# EAGLE design schematic (EAGLE 9.2.2)
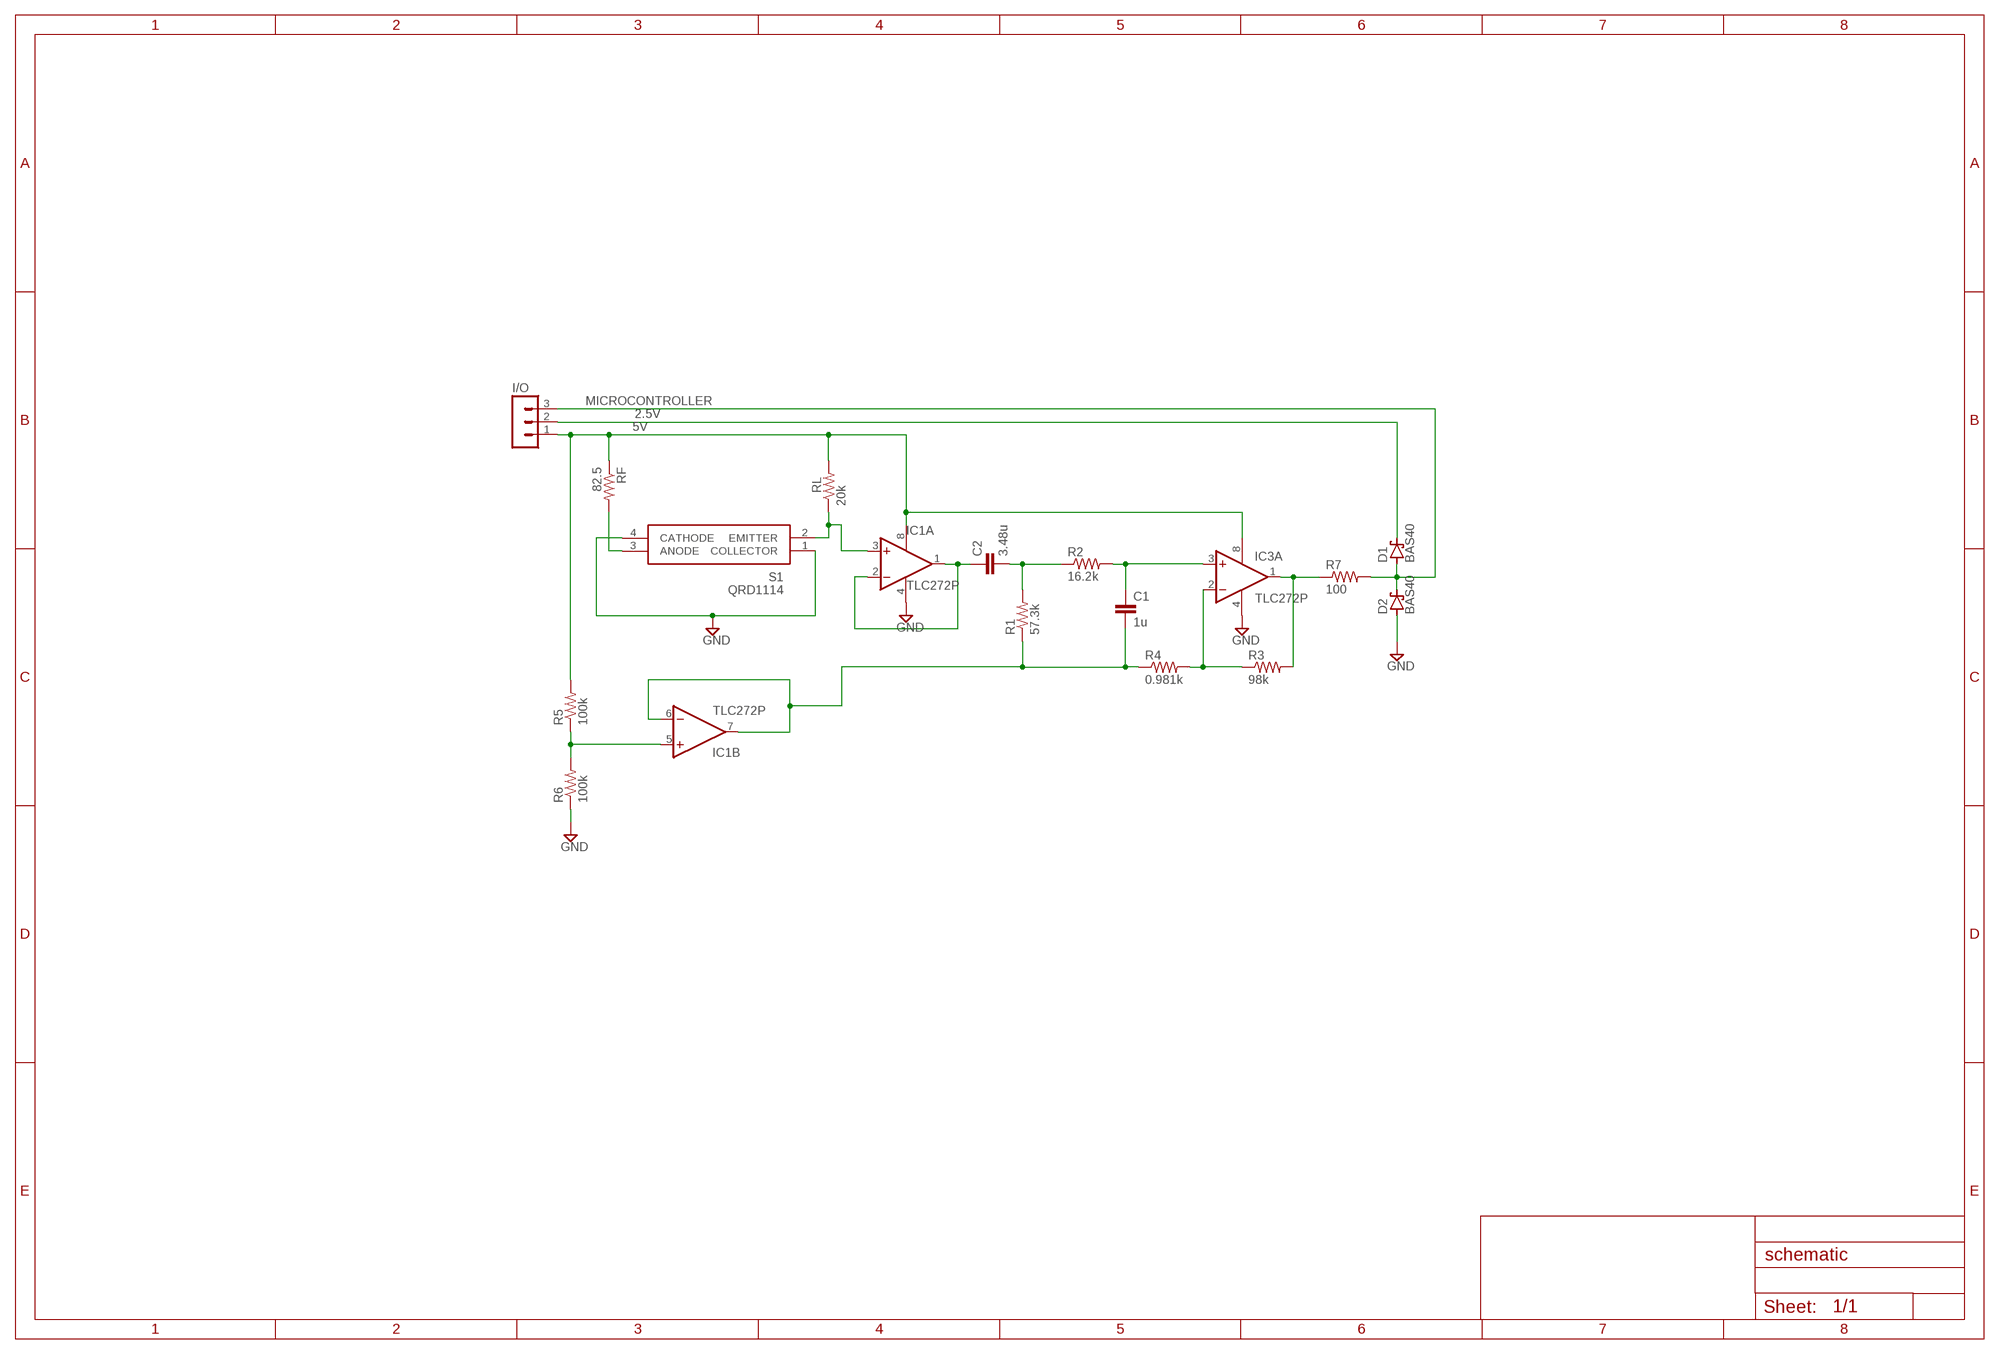
[diagram p0: schematic, sheet 1]

## Parts
C1  1u  C-EUC0402  [C0402]
C2  3.48u  C-EUC0402  [C0402]
D1  BAS40  [SOT23]
D2  BAS40  [SOT23]
I/O  MA03-1  [MA03-1]
IC1  TLC272P  [DIL08]
IC3  TLC272P  [DIL08]
R1  57.3k  R-US_M0805  [M0805]
R2  16.2k  R-US_M0805  [M0805]
R3  98k  R-US_M0805  [M0805]
R4  0.981k  R-US_M0805  [M0805]
R5  100k  R-US_M0805  [M0805]
R6  100k  R-US_0204/5  [0204/5]
R7  100  R-US_M0805  [M0805]
RF  82.5  R-US_M0805  [M0805]
RL  20k  R-US_M0805  [M0805]
S1  QRD1114  [CUSTOM_4L]

## Nets
2.5V: D1.3(C) I/O.2
5V: I/O.1 IC1.8(P:V+) IC3.8(P:V+) R5.2 RF.1 RL.2
GND: D2.1(A) IC1.4(P:V-) IC3.4(P:V-) R6.1 S1.1(COLLECTOR) S1.4(CATHODE)
MICROCONTROLLER: D1.1(A) D2.3(C) I/O.3 R7.2
N$1: RF.2 S1.3(ANODE)
N$2: IC1.3(A:+IN) RL.1 S1.2(EMITTER)
N$3: C2.1 IC1.1(A:OUT) IC1.2(A:-IN)
N$4: IC1.5(B:+IN) R5.1 R6.2
N$9: C2.2 R1.2 R2.1
N$10: C1.1 IC3.3(A:+IN) R2.2
N$11: C1.2 IC1.6(B:-IN) IC1.7(B:OUT) R1.1 R4.1
N$12: IC3.2(A:-IN) R3.1 R4.2
N$13: IC3.1(A:OUT) R3.2 R7.1
Unconnected: IC3.5(B:+IN) IC3.6(B:-IN) IC3.7(B:OUT)

## Library data of the parts
C1 C2 = rcl:C-EU: CAPACITOR, European symbol; SPICEPREFIX: C
D1 D2 = diode:BAS40: Silicon Schottky Diodes General-purpose diode for high-speed switching
I/O = con-lstb:MA03-1: PIN HEADER; OC_FARNELL: unknown; OC_NEWARK: unknown
IC1 IC3 = linear:TLC272: OP AMP
R1-R7 RF RL = rcl:R-US_: RESISTOR, American symbol; SPICEPREFIX: R
S1 = SamacSys_Parts:QRD1114: FAIRCHILD SEMICONDUCTOR - QRD1114 - OPTO SWITCH, REFLECTIVE Source: Datasheet <https://componentsearchengine.com/Datasheets/1/QRD1114.pdf>; DESCRIPTION: FAIRCHILD SEMICONDUCTOR - QRD1114 - OPTO SWITCH, REFLECTIVE; HEIGHT: mm; MANUFACTURER_NAME: Fairchild Semiconductor; MANUFACTURER_PART_NUMBER: QRD1114; MOUSER_PART_NUMBER: 512-QRD1114; MOUSER_PRICE-STOCK: https://www.mouser.com/Search/Refine.aspx?Keyword=512-QRD1114

## Board
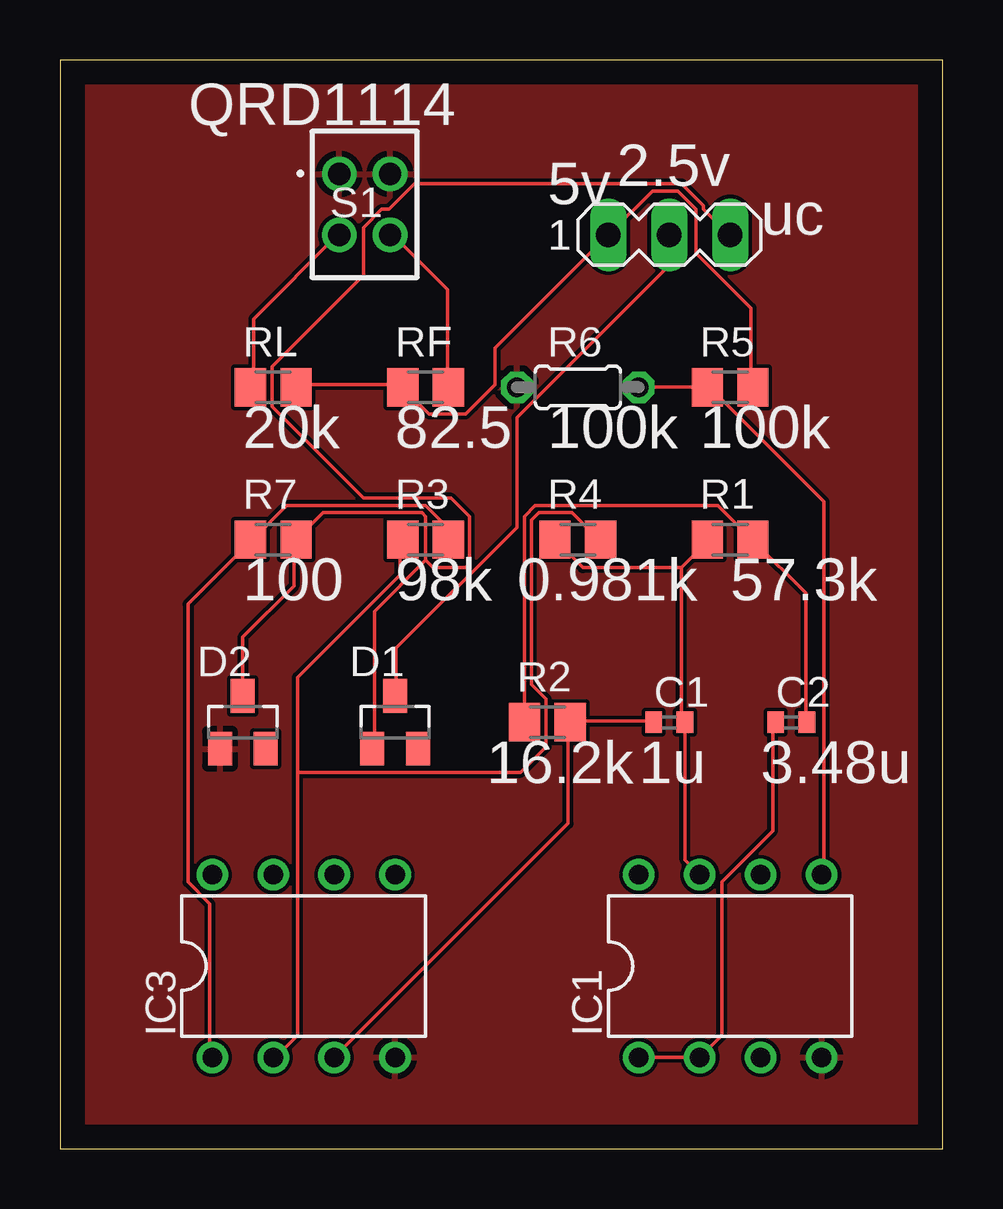
[diagram p1: board, top side]
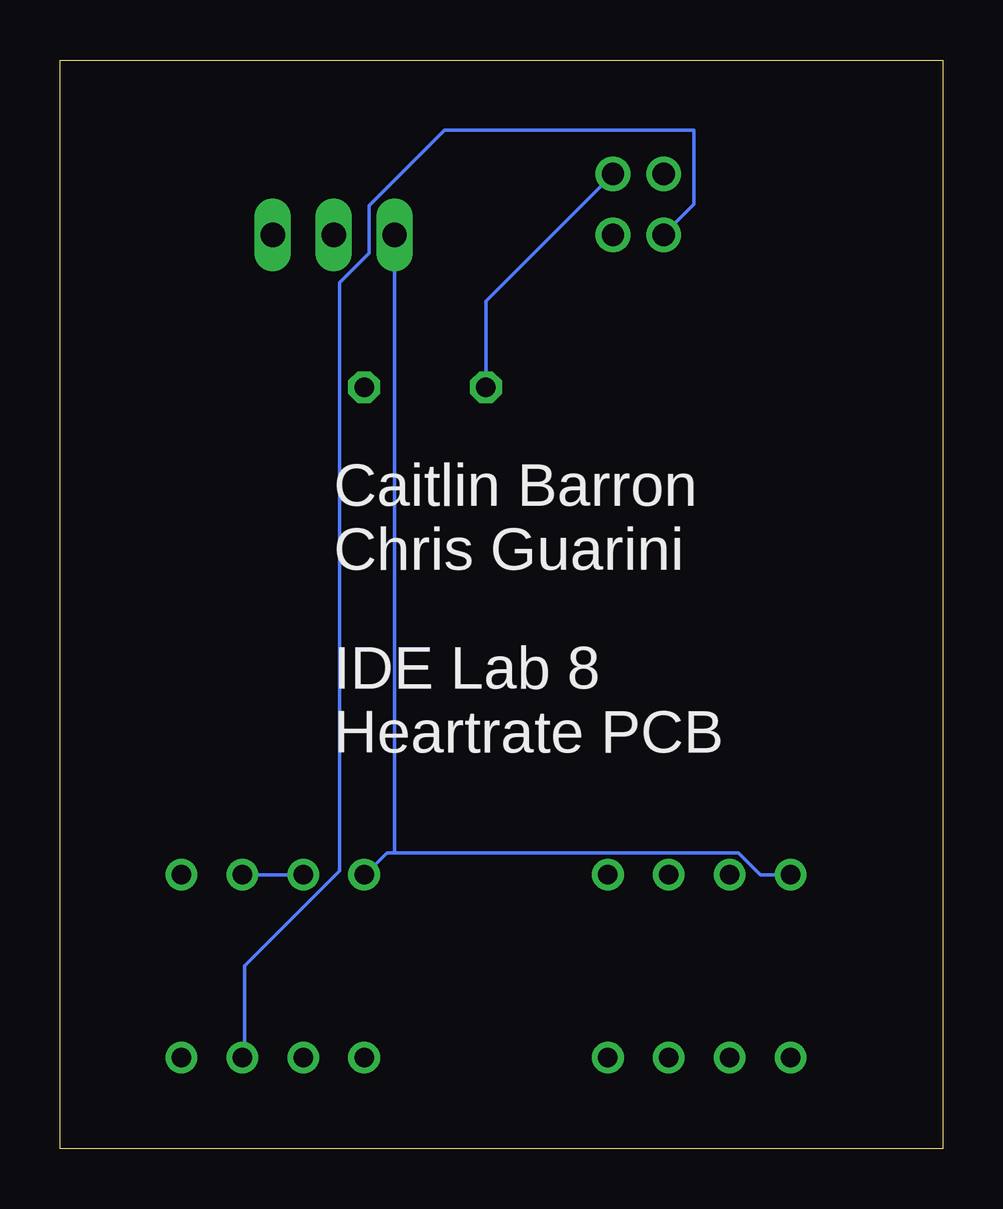
[diagram p2: board, bottom side, seen from below]

Size 36.81 x 45.39 mm. Coordinates in mm from the lower left corner, seen from the top.
Outline: 0,0 36.81,0 36.81,45.39 0,45.39 0,0
Copper layers (1*16): Top 0.035mm / dielectric 1.5mm / Bottom 0.035mm
Design rules "default": minimum track width 6mil, minimum drill 0.35mm, track to track 6mil, track to pad 6mil, pad to pad 6mil, via to via 6mil, smd to smd 6mil, copper to edge 40mil, drill to drill 6mil, minimum pad ring 10mil, minimum via ring 8mil, stop-mask expansion 4mil, vias tented up to drill 0mil, thermal gap 10mil

### Footprints (pad centres in the part's own frame; a part is rotated, then mirrored left to right if it is on the bottom)
C0402 = smd 0.7 x 0.9: 1 -0.65,0; 2 0.65,0
SOT23 = smd 1 x 1.4: 1 -0.95,-1.1; 2 0.95,-1.1; 3 0,1.1
MA03-1 = drill 1.016 long: 1 -2.54,0; 2 0,0; 3 2.54,0
DIL08 = drill 0.813 pad 1.27: 1 -3.81,-3.81; 2 -1.27,-3.81; 3 1.27,-3.81; 4 3.81,-3.81; 5 3.81,3.81; 6 1.27,3.81; 7 -1.27,3.81; 8 -3.81,3.81
M0805 = smd 1.3 x 1.6: 1 -0.95,0; 2 0.95,0
0204/5 = drill 0.813 octagon: 1 -2.54,0; 2 2.54,0
CUSTOM_4L = drill 0.92 pad 1.45: 1 -1.055,1.27; 2 -1.055,-1.27; 3 1.055,-1.27; 4 1.055,1.27

### Placement (x,y rotation side)
C1  25.4,17.78 0 top
C2  30.48,17.78 0 top
D1  13.97,17.78 0 top
D2  7.62,17.78 0 top
I/O  25.4,38.1 0 top
IC1  27.94,7.62 0 top
IC3  10.16,7.62 0 top
R1  27.94,25.4 0 top
R2  20.32,17.78 0 top
R3  15.24,25.4 0 top
R4  21.59,25.4 0 top
R5  27.94,31.75 0 top
R6  21.59,31.75 0 top
R7  8.89,25.4 0 top
RF  15.24,31.75 0 top
RL  8.89,31.75 0 top
S1  12.7,39.37 0 top

### Tracks (layer width: path | path; a pad name or v marks a point on that pad's centre or on a via)
2.5V
  Top 0.152: D1.3 14.02,18.9 14.02,20.88 19.05,25.91 19.05,30.48 25.3,36.73 25.3,38.1 I/O.2
5V
  Top 0.152: RL.2 9.91,31.85 14.17,31.85 RF.1 14.33,31.7 15.39,30.63 16.92,30.63 18.14,31.85 18.14,33.38 I/O.1 24.69,39.93 25.76,39.93 26.52,39.17 26.52,37.34 28.8,35.05 28.8,31.85 R5.2
  Bottom 0.152: IC3.8 7.62,11.43 8.53,12.34 22.86,12.34 | 22.86,12.34 23.16,12.34 24.08,11.43 IC1.8 | I/O.1 22.86,12.34
GND
  Bottom 0.152: R6.1 19.05,35.34 S1.4
  pour Top: 0,0 0,45.72 36.83,45.72 36.83,0
MICROCONTROLLER
  Top 0.152: D2.3 7.62,21.34 9.75,23.47 9.75,25.3 R7.2 9.91,25.45 10.97,26.52 15.09,26.52 15.24,26.36 15.24,24.54 | 15.24,24.54 13.11,22.4 13.11,16.76 D1.1 | 15.24,24.54 15.54,24.23 16.92,24.23 17.07,24.38 17.07,26.36 16.31,27.13 12.65,27.13 8.84,30.94 8.84,32.61 12.65,36.42 12.65,38.41 13.41,39.17 13.72,39.17 14.78,40.23 25.91,40.23 26.82,39.32 26.82,39.17 27.89,38.1 I/O.3
N$1
  Top 0.152: RF.2 16.15,31.85 16.15,35.81 13.87,38.1 S1.3
N$2
  Top 0.152: RL.1 8.08,31.85 8.08,34.59 11.58,38.1 S1.2
  Bottom 0.152: S1.2 10.38,39.37 10.38,42.47 20.78,42.47 23.93,39.32 23.93,37.34 25.15,36.12 25.15,11.58 29.11,7.62 29.11,3.81 IC1.3
N$3
  Top 0.152: C2.1 29.72,17.68 29.72,13.26 27.58,11.12 27.58,4.72 IC1.2 IC1.1
N$4
  Top 0.152: IC1.5 31.85,11.43 31.85,26.98 27.13,31.7 R5.1 R6.2
N$9
  Top 0.152: C2.2 31.09,17.83 31.09,23.16 28.96,25.3 R1.2 28.8,25.45 27.43,26.82 19.81,26.82 19.36,26.36 19.36,17.83 R2.1
N$10
  Top 0.152: C1.1 24.69,17.83 21.34,17.83 R2.2 21.18,17.68 21.18,13.56 IC3.3
N$11
  Top 0.152: 25.91,24.23 21.79,24.23 20.73,25.3 R4.1 | 25.91,24.23 26.98,25.3 R1.1 | IC1.7 26.06,12.04 26.06,17.68 C1.2 25.91,17.83 25.91,24.23
  Bottom 0.152: IC1.7 IC1.6
N$12
  Top 0.152: 9.91,15.7 9.91,4.72 8.99,3.81 IC3.2 | 9.91,15.7 9.91,19.66 14.17,23.93 14.17,25.3 R3.1 | 9.91,15.7 19.2,15.7 20.27,16.76 20.27,18.75 19.66,19.36 19.66,26.21 19.96,26.52 21.34,26.52 22.4,25.45 R4.2
N$13
  Top 0.152: R3.2 16.15,25.45 16.15,25.91 15.24,26.82 9.45,26.82 8.08,25.45 R7.1 7.92,25.3 5.33,22.71 5.33,11.12 6.25,10.21 6.25,3.81 IC3.1

### Text on the board
tPlace: QRD1114 | 2.5v | 5v | uc | 20k | 82.5 | 100k | 100k | 100 | 98k | 0.981k | 57.3k | 16.2k | 1u | 3.48u
bPlace: Caitlin Barron / Chris Guarini | IDE Lab 8 / Heartrate PCB